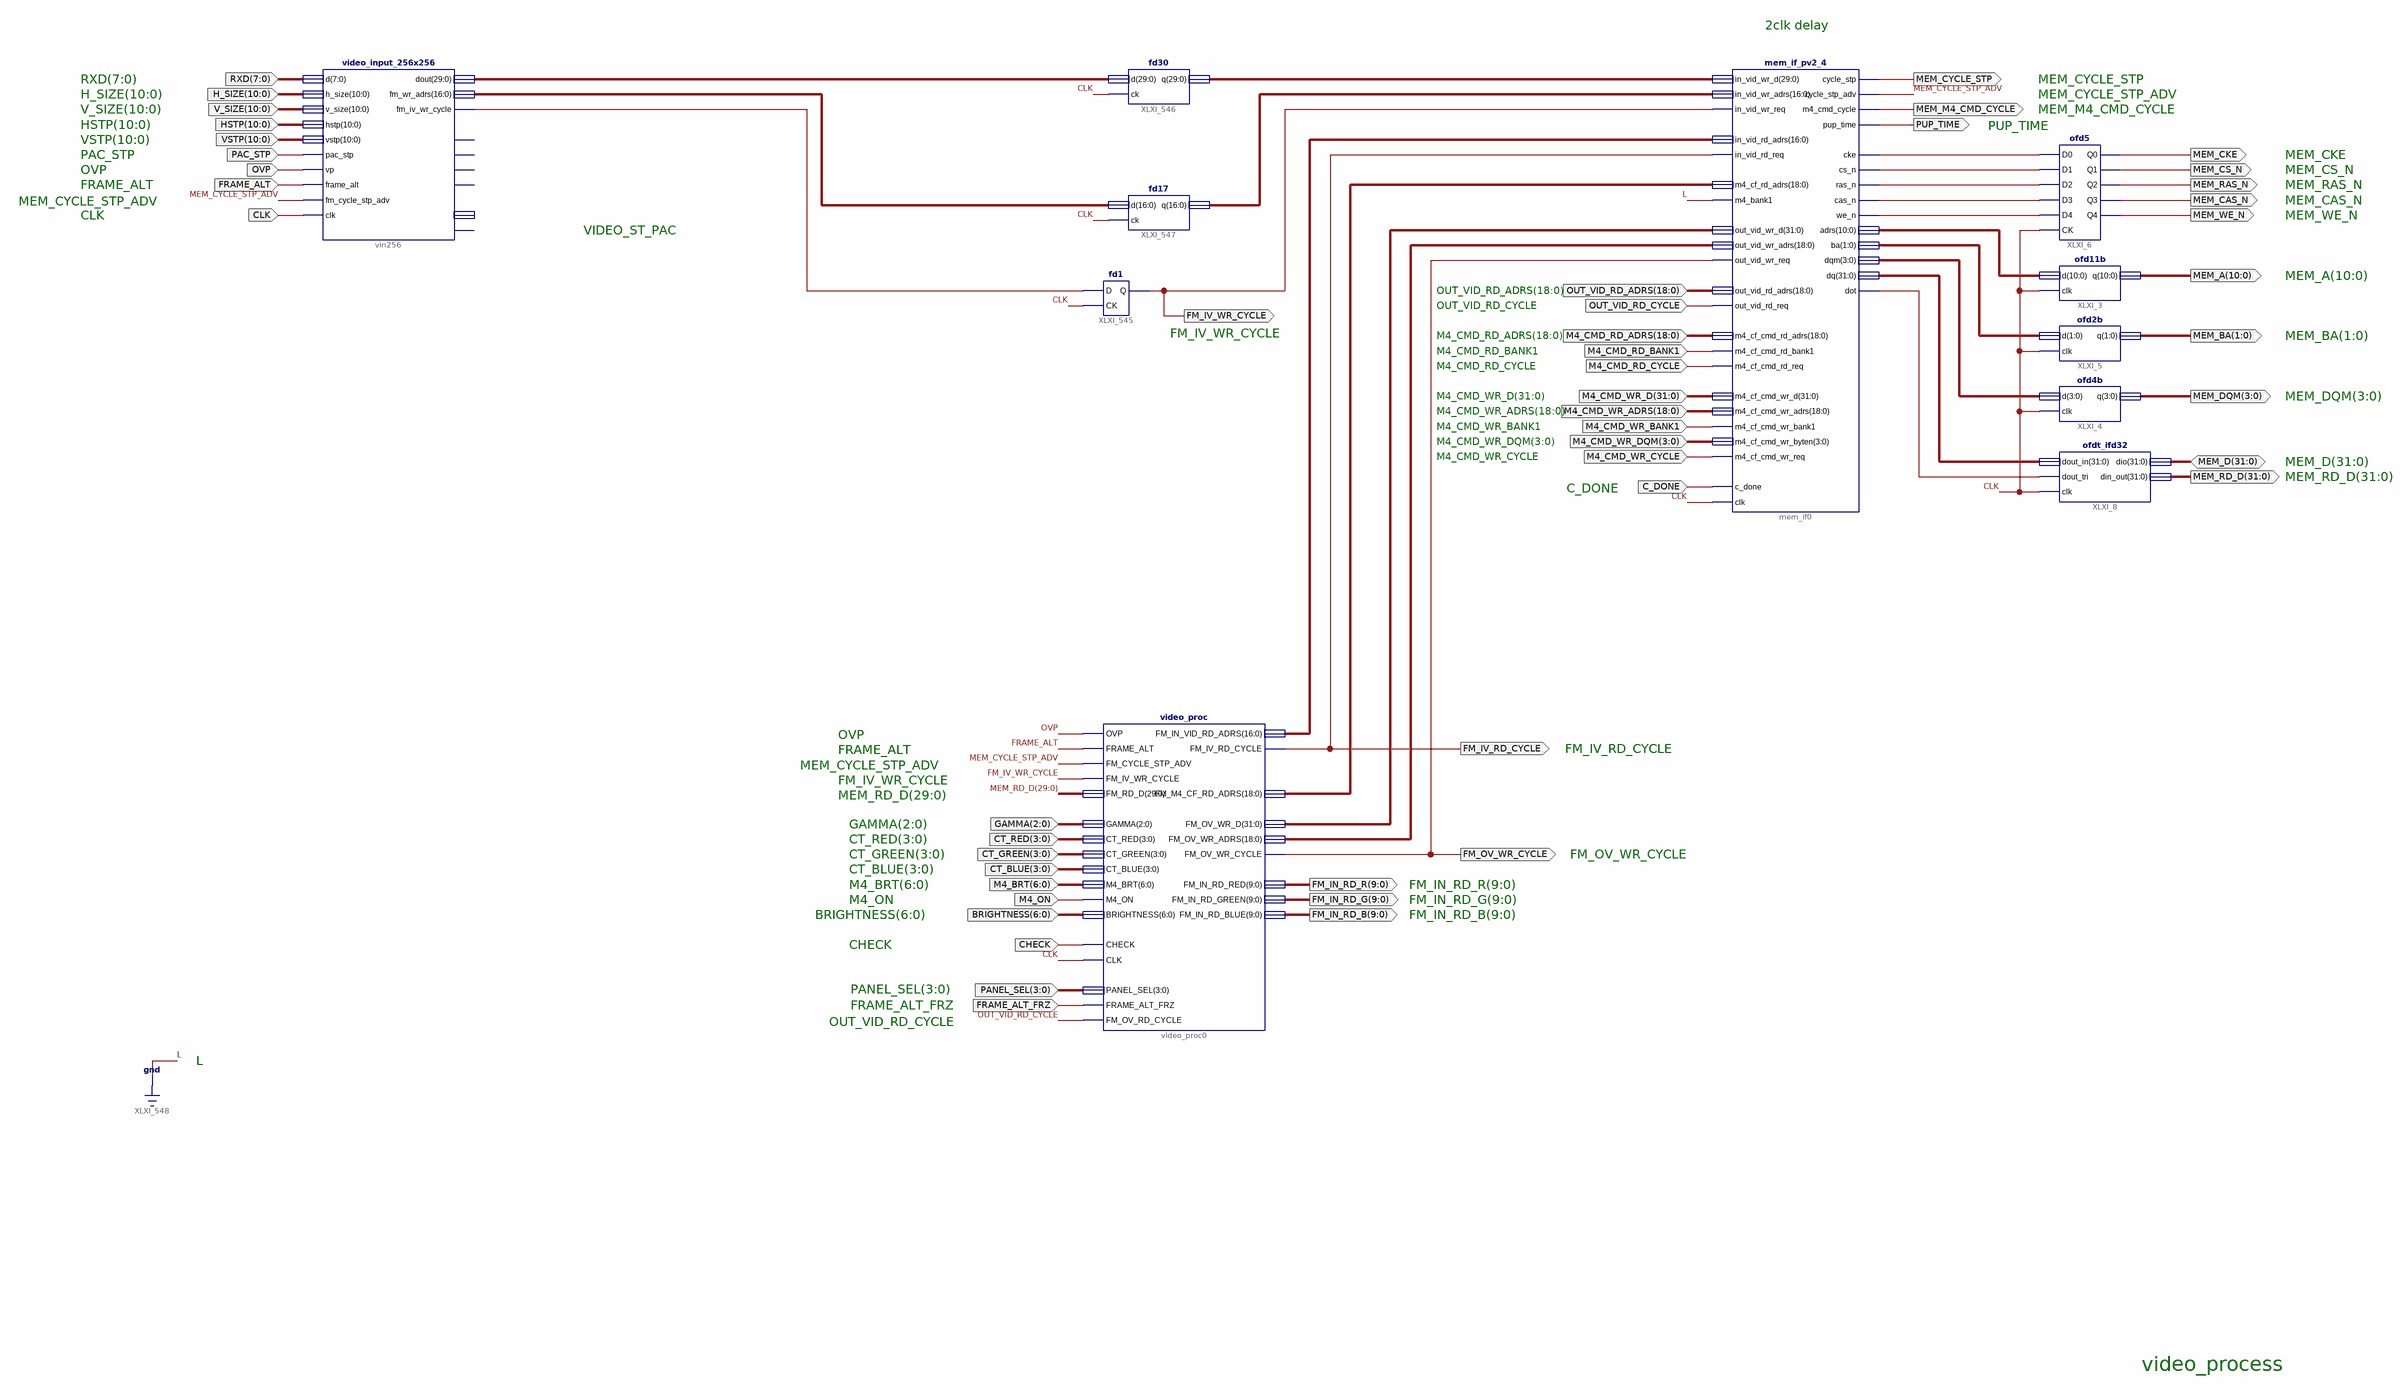
[diagram p0: schematic sheet 1]
// Xilinx ISE schematic video_process.sch (aspartan6) as structural Verilog: 11 symbols, 49 ports
module video_process (
  input  OVP,
  input  CLK,
  input  FRAME_ALT,
  input  [7:0] RXD,
  input  [10:0] H_SIZE,
  input  [10:0] V_SIZE,
  input  [10:0] HSTP,
  input  [10:0] VSTP,
  input  PAC_STP,
  input  C_DONE,
  input  [18:0] OUT_VID_RD_ADRS,
  input  OUT_VID_RD_CYCLE,
  input  [2:0] GAMMA,
  input  [3:0] CT_RED,
  input  [3:0] CT_GREEN,
  input  [3:0] CT_BLUE,
  input  [6:0] M4_BRT,
  input  [3:0] PANEL_SEL,
  input  M4_ON,
  input  CHECK,
  input  M4_CMD_RD_CYCLE,
  input  M4_CMD_RD_BANK1,
  input  [18:0] M4_CMD_RD_ADRS,
  input  M4_CMD_WR_CYCLE,
  input  [3:0] M4_CMD_WR_DQM,
  input  M4_CMD_WR_BANK1,
  input  [18:0] M4_CMD_WR_ADRS,
  input  [31:0] M4_CMD_WR_D,
  input  FRAME_ALT_FRZ,
  input  [6:0] BRIGHTNESS,
  inout  [31:0] MEM_D,
  output MEM_CKE,
  output MEM_CS_N,
  output MEM_RAS_N,
  output MEM_CAS_N,
  output MEM_WE_N,
  output [3:0] MEM_DQM,
  output [31:0] MEM_RD_D,
  output [1:0] MEM_BA,
  output [10:0] MEM_A,
  output MEM_M4_CMD_CYCLE,
  output PUP_TIME,
  output MEM_CYCLE_STP,
  output FM_IV_WR_CYCLE,
  output FM_IV_RD_CYCLE,
  output FM_OV_WR_CYCLE,
  output [9:0] FM_IN_RD_G,
  output [9:0] FM_IN_RD_R,
  output [9:0] FM_IN_RD_B
);

  wire MEM_CYCLE_STP_ADV, XLXN_29, XLXN_123, XLXN_124, XLXN_125, XLXN_126, XLXN_127, XLXN_393;
  wire [1:0] XLXN_120;
  wire [3:0] XLXN_24;
  wire [10:0] XLXN_121;
  wire [16:0] XLXN_146, XLXN_148, XLXN_662;
  wire [18:0] XLXN_657, XLXN_658;
  wire [29:0] XLXN_655, XLXN_661;
  wire [31:0] XLXN_26, XLXN_180;

  ofd5 XLXI_6 (
    .D0(XLXN_127), .Q0(MEM_CKE), .D1(XLXN_126), .D2(XLXN_125), .D3(XLXN_124), .D4(XLXN_123), .CK(CLK),
    .Q1(MEM_CS_N), .Q2(MEM_RAS_N), .Q3(MEM_CAS_N), .Q4(MEM_WE_N));
  ofd4b XLXI_4 (.d(XLXN_24), .clk(CLK), .q(MEM_DQM));
  ofdt_ifd32 XLXI_8 (.dout_tri(XLXN_29), .dout_in(XLXN_26), .din_out(MEM_RD_D), .dio(MEM_D), .clk(CLK));
  ofd2b XLXI_5 (.d(XLXN_120), .clk(CLK), .q(MEM_BA));
  ofd11b XLXI_3 (.d(XLXN_121), .clk(CLK), .q(MEM_A));
  fd1 XLXI_545 (.D(XLXN_393), .CK(CLK), .Q(FM_IV_WR_CYCLE));
  video_proc video_proc0 (
    .GAMMA(GAMMA), .CT_RED(CT_RED), .CT_GREEN(CT_GREEN), .CT_BLUE(CT_BLUE), .OVP(OVP), .CLK(CLK),
    .M4_BRT(M4_BRT), .M4_ON(M4_ON), .FM_CYCLE_STP_ADV(MEM_CYCLE_STP_ADV), .FM_IV_WR_CYCLE(FM_IV_WR_CYCLE),
    .FRAME_ALT(FRAME_ALT), .CHECK(CHECK), .BRIGHTNESS(BRIGHTNESS), .FM_RD_D(MEM_RD_D[29:0]),
    .PANEL_SEL(PANEL_SEL), .FRAME_ALT_FRZ(FRAME_ALT_FRZ), .FM_IN_RD_RED(FM_IN_RD_R),
    .FM_IN_RD_GREEN(FM_IN_RD_G), .FM_IN_RD_BLUE(FM_IN_RD_B), .FM_OV_WR_D(XLXN_180), .FM_OV_WR_ADRS(XLXN_657),
    .FM_OV_WR_CYCLE(FM_OV_WR_CYCLE), .FM_IV_RD_CYCLE(FM_IV_RD_CYCLE), .FM_IN_VID_RD_ADRS(XLXN_148),
    .FM_M4_CF_RD_ADRS(XLXN_658), .FM_OV_RD_CYCLE(OUT_VID_RD_CYCLE));
  fd30 XLXI_546 (.ck(CLK), .d(XLXN_661), .q(XLXN_655));
  fd17 XLXI_547 (.d(XLXN_662), .ck(CLK), .q(XLXN_146));
  mem_if_pv2_4 mem_if0 (
    .c_done(C_DONE), .clk(CLK), .in_vid_wr_req(FM_IV_WR_CYCLE), .in_vid_rd_req(FM_IV_RD_CYCLE),
    .m4_bank1(1'b0), .out_vid_rd_req(OUT_VID_RD_CYCLE), .m4_cf_cmd_rd_req(M4_CMD_RD_CYCLE),
    .m4_cf_cmd_rd_bank1(M4_CMD_RD_BANK1), .m4_cf_cmd_wr_req(M4_CMD_WR_CYCLE),
    .m4_cf_cmd_wr_bank1(M4_CMD_WR_BANK1), .out_vid_wr_req(FM_OV_WR_CYCLE), .in_vid_wr_adrs(XLXN_146),
    .in_vid_wr_d(XLXN_655), .in_vid_rd_adrs(XLXN_148), .m4_cf_rd_adrs(XLXN_658),
    .out_vid_rd_adrs(OUT_VID_RD_ADRS), .m4_cf_cmd_rd_adrs(M4_CMD_RD_ADRS),
    .m4_cf_cmd_wr_adrs(M4_CMD_WR_ADRS), .m4_cf_cmd_wr_byten(M4_CMD_WR_DQM), .m4_cf_cmd_wr_d(M4_CMD_WR_D),
    .out_vid_wr_adrs(XLXN_657), .out_vid_wr_d(XLXN_180), .cycle_stp(MEM_CYCLE_STP),
    .cycle_stp_adv(MEM_CYCLE_STP_ADV), .pup_time(PUP_TIME), .m4_cmd_cycle(MEM_M4_CMD_CYCLE), .cke(XLXN_127),
    .cs_n(XLXN_126), .ras_n(XLXN_125), .cas_n(XLXN_124), .we_n(XLXN_123), .dot(XLXN_29), .ba(XLXN_120),
    .adrs(XLXN_121), .dqm(XLXN_24), .dq(XLXN_26));
  video_input_256x256 vin256 (
    .pac_stp(PAC_STP), .vp(OVP), .fm_cycle_stp_adv(MEM_CYCLE_STP_ADV), .frame_alt(FRAME_ALT), .clk(CLK),
    .h_size(H_SIZE), .v_size(V_SIZE), .hstp(HSTP), .vstp(VSTP), .d(RXD), .fm_iv_wr_cycle(XLXN_393),
    .dout(XLXN_661), .fm_wr_adrs(XLXN_662));  // open: video_st_pac, pix_ce, video_stp, lm_wr_stp, lm_we, pad_adrs

  // Notes on the sheet:
  //   2clk delay
  //   RXD(7:0)
  //   MEM_CYCLE_STP
  //   H_SIZE(10:0)
  //   MEM_CYCLE_STP_ADV
  //   V_SIZE(10:0)
  //   MEM_M4_CMD_CYCLE
  //   HSTP(10:0)
  //   PUP_TIME
  //   VSTP(10:0)
  //   PAC_STP
  //   MEM_CKE
  //   OVP
  //   MEM_CS_N
  //   FRAME_ALT
  //   MEM_RAS_N
  //   MEM_CAS_N
  //   MEM_CYCLE_STP_ADV
  //   CLK
  //   MEM_WE_N
  //   VIDEO_ST_PAC
  //   MEM_A(10:0)
  //   OUT_VID_RD_ADRS(18:0)
  //   OUT_VID_RD_CYCLE
  //   FM_IV_WR_CYCLE
  //   M4_CMD_RD_ADRS(18:0)
  //   MEM_BA(1:0)
  //   M4_CMD_RD_BANK1
  //   M4_CMD_RD_CYCLE
  //   M4_CMD_WR_D(31:0)
  //   MEM_DQM(3:0)
  //   M4_CMD_WR_ADRS(18:0)
  //   M4_CMD_WR_BANK1
  //   M4_CMD_WR_DQM(3:0)
  //   M4_CMD_WR_CYCLE
  //   MEM_D(31:0)
  //   MEM_RD_D(31:0)
  //   C_DONE
  //   OVP
  //   FM_IV_RD_CYCLE
  //   FRAME_ALT
  //   MEM_CYCLE_STP_ADV
  //   FM_IV_WR_CYCLE
  //   MEM_RD_D(29:0)
  //   GAMMA(2:0)
  //   CT_RED(3:0)
  //   CT_GREEN(3:0)
  //   FM_OV_WR_CYCLE
  //   CT_BLUE(3:0)
  //   M4_BRT(6:0)
  //   FM_IN_RD_R(9:0)
  //   M4_ON
  //   FM_IN_RD_G(9:0)
  //   BRIGHTNESS(6:0)
  //   FM_IN_RD_B(9:0)
  //   CHECK
  //   PANEL_SEL(3:0)
  //   FRAME_ALT_FRZ
  //   OUT_VID_RD_CYCLE
  //   L
  //   video_process
endmodule
